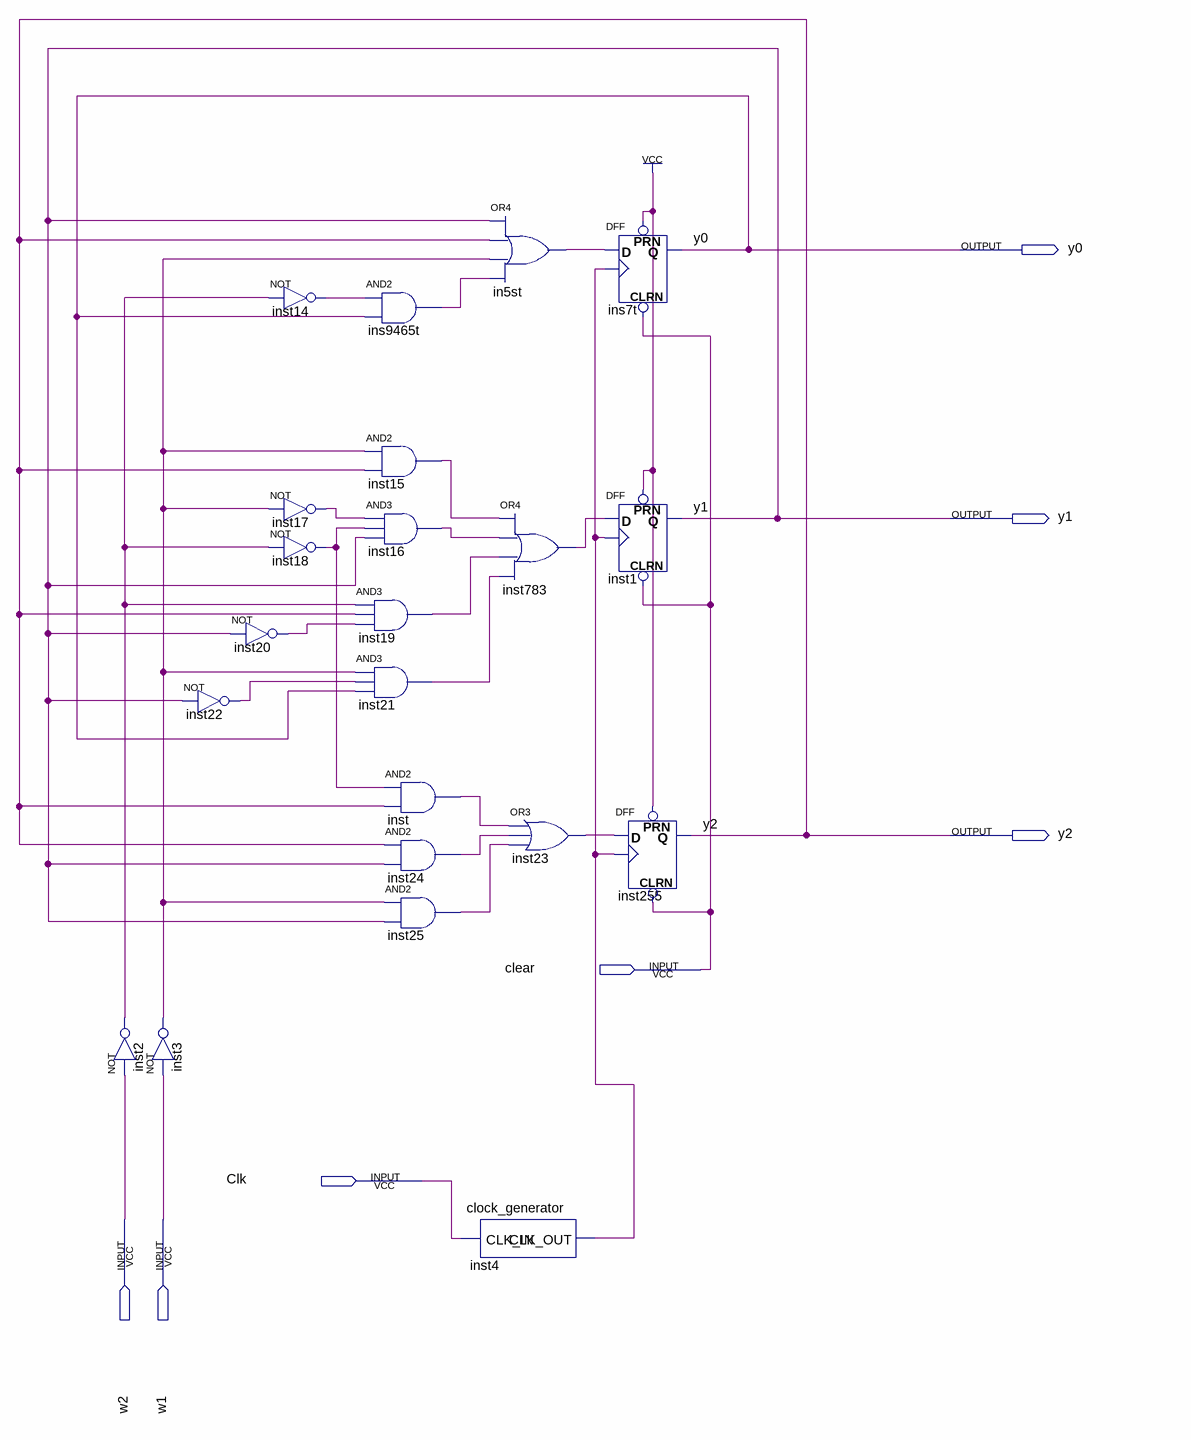
[diagram p0: schematic sheet]
// Quartus schematic addsub.bdf as structural Verilog: 22 symbols, 7 pins
module addsub (
  input  clear,
  input  Clk,
  input  w2,
  input  w1,
  output y0,
  output y1,
  output y2
);

  wire in5st_out, ins9465t_out, inst2_out, inst3_out, inst4_clk_out, inst14_out, inst15_out, inst16_out,
       inst17_out, inst18_out, inst19_out, inst20_out, inst21_out, inst22_out, inst23_out, inst24_out,
       inst25_out, inst783_out, inst_out;

  not inst2 (inst2_out, w2);
  not inst22 (inst22_out, y1);
  not inst3 (inst3_out, w1);
  not inst14 (inst14_out, inst2_out);
  not inst17 (inst17_out, inst3_out);
  not inst18 (inst18_out, inst2_out);
  not inst20 (inst20_out, y1);
  and inst19 (inst19_out, inst2_out, y2, inst20_out);
  and inst21 (inst21_out, inst3_out, inst22_out, y0);
  and ins9465t (ins9465t_out, inst14_out, y0);
  and inst15 (inst15_out, inst3_out, y2);
  and inst16 (inst16_out, inst17_out, inst18_out, y1);
  and inst (inst_out, inst18_out, y2);
  and inst24 (inst24_out, y2, y1);
  and inst25 (inst25_out, inst3_out, y1);
  or in5st (in5st_out, y1, y2, inst3_out, ins9465t_out);
  or inst783 (inst783_out, inst15_out, inst16_out, inst19_out, inst21_out);
  or inst23 (inst23_out, inst_out, inst24_out, inst25_out);
  clock_generator inst4 (.CLK_IN(Clk), .CLK_OUT(inst4_clk_out));
  DFF ins7t (.CLRN(clear), .CLK(inst4_clk_out), .D(in5st_out), .PRN(1'b1), .Q(y0));
  DFF inst1 (.CLRN(clear), .CLK(inst4_clk_out), .D(inst783_out), .PRN(1'b1), .Q(y1));
  DFF inst255 (.CLRN(clear), .CLK(inst4_clk_out), .D(inst23_out), .PRN(1'b1), .Q(y2));
endmodule
